# Altium project EL-03 Wheel Module.PrjPcb
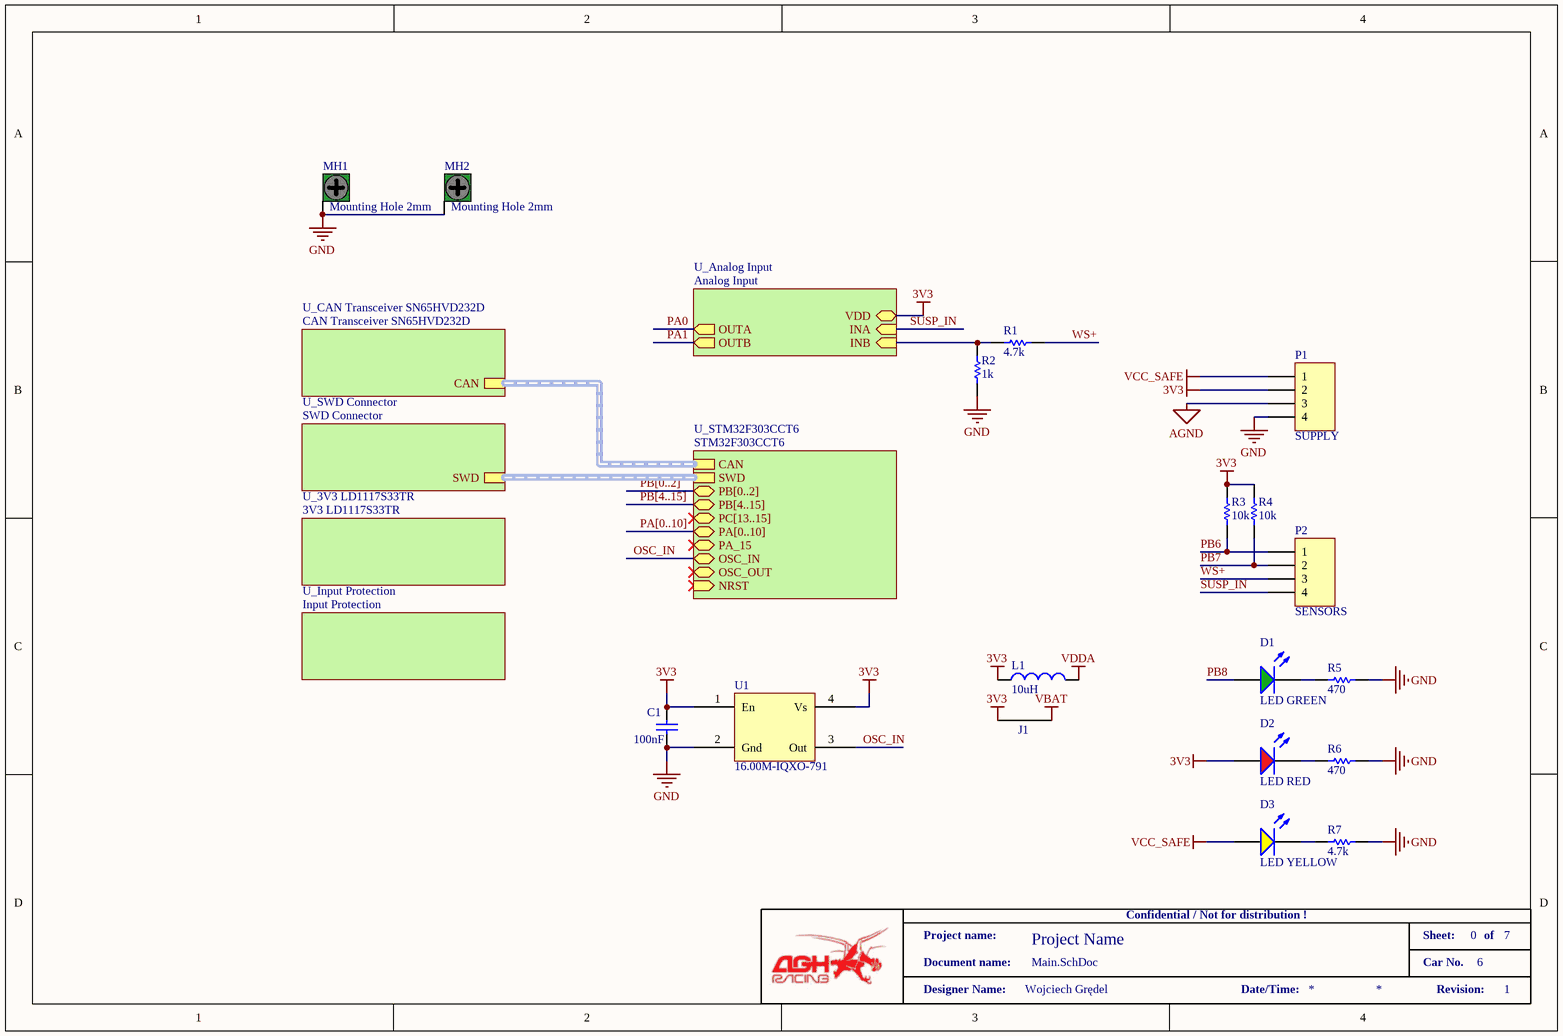
[diagram p0: Main.SchDoc]
1 sheet, 18 parts. Net scope: hierarchical (ports join the sheet entries above them; power ports are global).
Board file: PCB1.PcbDoc

## Sheet Main.SchDoc
size A4; Author: Wojciech Grędel; CompanyName: AGH Racing; DocumentNumber: 1; Revision: 1; SheetNumber: 0; SheetTotal: 7; CarNumber: 6; ProjectName: Project Name

### Parts
C1  value 100nF  [CAP_0603_IPC_MD]  (hidden comment: Cap)
D1  LED GREEN  [LED_0603_GREEN_IPC_MD]
D2  LED RED  [LED_0603_RED_IPC_MD]
D3  LED YELLOW  [LED_0603_YELLOW_IPC_MD]
J1  NetTie  [NETTIE]  (value not drawn)  (net tie, no BOM)
L1  value 10uH  [IND_0603_IPC_HD]  (hidden comment: Ind)
MH1  Mounting Hole 2mm  [MOUNTING HOLE 2mm]  (no BOM)
MH2  Mounting Hole 2mm  [MOUNTING HOLE 2mm]  (no BOM)
P1  SUPPLY  [WIRE_PADS_4]
P2  SENSORS  [WIRE_PADS_4]
R1  value 4.7k  [RES_0603_IPC_HD]  (hidden comment: Res)
R2  value 1k  [RES_0603_IPC_HD]  (hidden comment: Res)
R3  value 10k  [RES_0603_IPC_HD]  (hidden comment: Res)
R4  value 10k  [RES_0603_IPC_HD]  (hidden comment: Res)
R5  value 470  [RES_0603_IPC_MD]  (hidden comment: Res)
R6  value 470  [RES_0603_IPC_MD]  (hidden comment: Res)
R7  value 4.7k  [RES_0603_IPC_MD]  (hidden comment: Res)
U1  16.00M-IQXO-791  [ICLCX18]

### Sub-sheets
U_3V3 LD1117S33TR = 3V3 LD1117S33TR (file not in this document): no entries
U_Analog Input = Analog Input (file not in this document): OUTB (out), OUTA (out), INB (in), INA (in), VDD (bidir)
U_CAN Transceiver SN65HVD232D = CAN Transceiver SN65HVD232D (file not in this document): CAN (harness CAN)
U_Input Protection = Input Protection (file not in this document): no entries
U_STM32F303CCT6 = STM32F303CCT6 (file not in this document): CAN (harness CAN), SWD (harness SWD), PB[0..2] (bidir), PB[4..15] (bidir), PC[13..15] (bidir), PA[0..10] (bidir), PA_15 (bidir), OSC_IN (bidir), OSC_OUT (bidir), NRST (in)
U_SWD Connector = SWD Connector (file not in this document): SWD (harness SWD)

### Nets
3V3: C1.2 D2.1(A) J1.1 L1.1 P1.2 R3.2 R4.2 U1.1(En) U1.4(Vs) ; sheet U_Analog Input/VDD
AGND: P1.3
GND: C1.1 MH1.MOUNTING MH2.MOUNTING P1.4 R2.1 R5.1 R6.1 R7.1 U1.2(Gnd)
VBAT: J1.2
VCC_SAFE: D3.1(A) P1.1
VDDA: L1.2
OSC_IN: U1.3(Out) ; sheet U_STM32F303CCT6/OSC_IN
PA0: sheet U_Analog Input/OUTA
PA1: sheet U_Analog Input/OUTB
PB6: P2.1 R3.1
PB7: P2.2 R4.1
PB8: D1.1(A)
SUSP_IN: P2.4 ; sheet U_Analog Input/INA
WS+: P2.3 R1.1
NetD1_2: D1.2(K) R5.2
NetD2_2: D2.2(K) R6.2
NetD3_2: D3.2(K) R7.2
NetR1_2: R1.2 R2.2 ; sheet U_Analog Input/INB

### Buses and harness runs
bus PA[0..10] = sheet U_STM32F303CCT6/PA[0..10]
bus PB[0..2] = sheet U_STM32F303CCT6/PB[0..2]
bus PB[4..15] = sheet U_STM32F303CCT6/PB[4..15]
harness sheet U_CAN Transceiver SN65HVD232D/CAN = sheet U_STM32F303CCT6/CAN
harness sheet U_STM32F303CCT6/SWD = sheet U_SWD Connector/SWD

### Notes on the sheet
- Confidential / Not for distribution !
- Project name:
- Document name:
- Sheet:
- Car No.
- of
- Designer Name:
- Date/Time:
- Revision:

### Library data of the parts
C1 = Cap: Capacitor
L1 = Ind: Inductor
MH1 MH2 = Mounting Hole
P1 P2 = Header 4: Header, 4-Pin
R1-R7 = Res: Resistor
U1 = 16.00M-IQXO-791: Crystal Clock Oscillator; Manufacturer: IQD FREQUENCY PRODUCTS; MPN: LFSPXO066657CUTT; Supplier: TME; SPN: 16.00M-IQXO-791; Name: 16.00M-IQXO-791